# Altium schematic sheet DAC.SchDoc
size A4; SheetNumber: 2; SheetTotal: 6
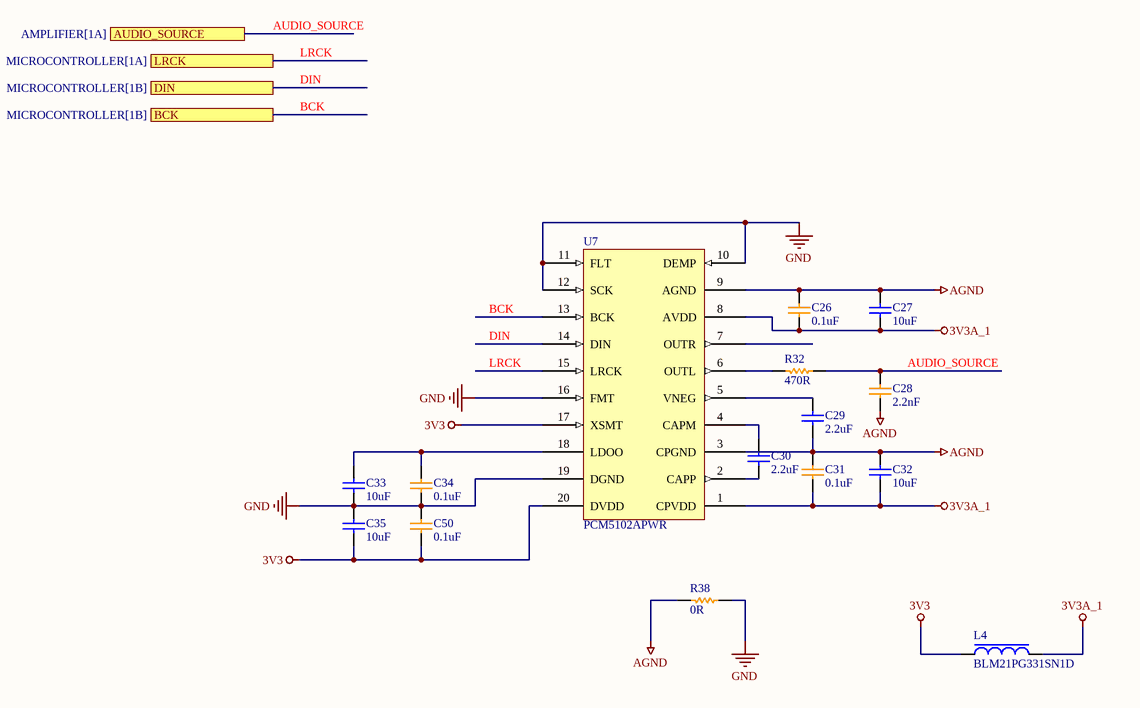
[diagram p0: DAC.SchDoc]

## Parts
C26  0.1uF  [CAP-0603]
C27  10uF  [CAP-0805]
C28  2.2nF  [CAP-0603]
C29  2.2uF  [CAP-0805]
C30  2.2uF  [CAP-0805]
C31  0.1uF  [CAP-0603]
C32  10uF  [CAP-0805]
C33  10uF  [CAP-0805]
C34  0.1uF  [CAP-0603]
C35  10uF  [CAP-0805]
C50  0.1uF  [CAP-0603]
L4  BLM21PG331SN1D  [FB-0805]
R32  470R  [RES-0603]
R38  0R  [RES-0603]
U7  PCM5102APWR  [20-TSSOP]

## Ports
AUDIO_SOURCE (see AMPLIFIER[1A]), BCK (see MICROCONTROLLER[1B]), DIN (see MICROCONTROLLER[1B]), LRCK (see MICROCONTROLLER[1A])

## Nets
3V3: C35.2 C50.2 L4.1 U7.17(XSMT) U7.20(DVDD)
3V3A_1: C26.1 C27.1 C31.1 C32.1 L4.2 U7.1(CPVDD) U7.8(AVDD)
AGND: C26.2 C27.2 C28.2 C29.1 C31.2 C32.2 R38.1 U7.3(CPGND) U7.9(AGND)
GND: C33.2 C34.2 C35.1 C50.1 R38.2 U7.10(DEMP) U7.11(FLT) U7.12(SCK) U7.16(FMT) U7.19(DGND)
AUDIO_SOURCE: C28.1 R32.2 ; port AUDIO_SOURCE
BCK: U7.13(BCK) ; port BCK
DIN: U7.14(DIN) ; port DIN
LRCK: U7.15(LRCK) ; port LRCK
NetC29_2: C29.2 U7.5(VNEG)
NetC30_1: C30.1 U7.2(CAPP)
NetC30_2: C30.2 U7.4(CAPM)
NetC33_1: C33.1 C34.1 U7.18(LDOO)
NetR32_1: R32.1 U7.6(OUTL)

Not connected (* = marked no-connect by the designer): U7 7(OUTR)

## Library data of the parts
C26 C31 C34 C50 = CAP-0603: CAP CER 0.1UF 10V X7R 0603
C27 C32 C35 = CAP-0805: CAP CER 10UF 10V X5R 0805
C28 = CAP-0603: CAP CER 2.2NF 10V C0G/NP0 0603
C29 C30 = CAP-0805: CAP CER 2.2UF 10V X5R 0805
C33 = CAP-0805: CAP CER 10UF 16V X5R 0805
L4 = FB-0805: FERRITE BEAD 330 OHM 0805 1LN
R32 R38 = RES-0603: RES SMD 470 OHM 1% 1/10W 0603
U7 = PCM5102APWR: IC DAS/ADC/DAC SPECIAL 20-TSSOP